# EAGLE design AUDIO_005 (EAGLE 9.6.2)
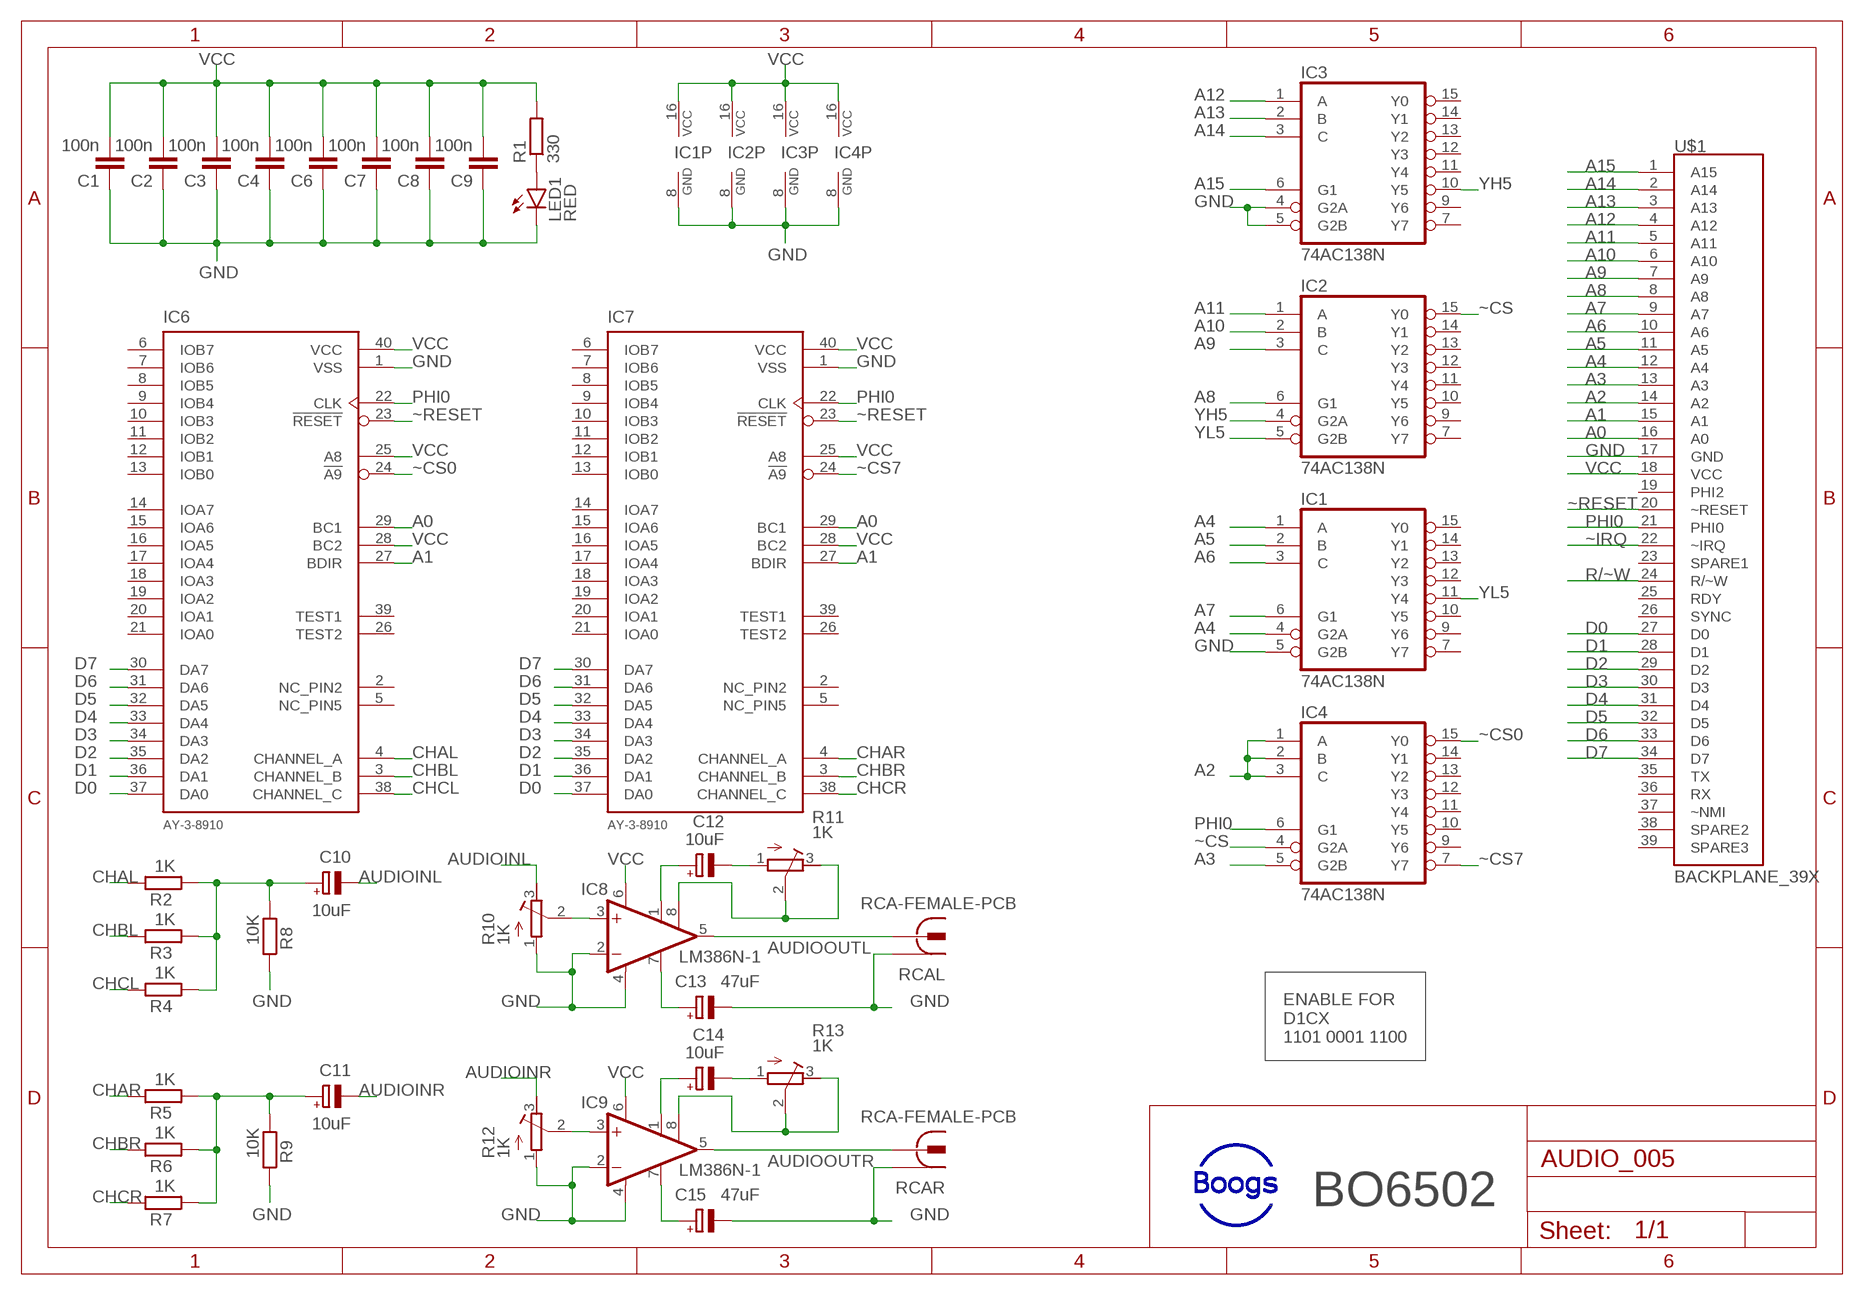
[diagram p0: schematic, sheet 1]

## Parts
C1  100n  C-EU025-025X050  [C025-025X050]
C2  100n  C-EU025-025X050  [C025-025X050]
C3  100n  C-EU025-025X050  [C025-025X050]
C4  100n  C-EU025-025X050  [C025-025X050]
C6  100n  C-EU025-025X050  [C025-025X050]
C7  100n  C-EU025-025X050  [C025-025X050]
C8  100n  C-EU025-025X050  [C025-025X050]
C9  100n  C-EU025-025X050  [C025-025X050]
C10  10uF  CPOL-EUB45181A  [B45181A]
C11  10uF  CPOL-EUB45181A  [B45181A]
C12  10uF  CPOL-EUB45181A  [B45181A]
C13  47uF  CPOL-EUB45181A  [B45181A]
C14  10uF  CPOL-EUB45181A  [B45181A]
C15  47uF  CPOL-EUB45181A  [B45181A]
IC1  74AC138N  [DIL16]
IC2  74AC138N  [DIL16]
IC3  74AC138N  [DIL16]
IC4  74AC138N  [DIL16]
IC6  AY-3-8910  [DIL40]
IC7  AY-3-8910  [DIL40]
IC8  LM386N-1  [DIL08]
IC9  LM386N-1  [DIL08]
LED1  RED  LED5MM  [LED5MM]
R1  330  R-EU_0207/10  [0207/10]
R2  1K  R-EU_0207/10  [0207/10]
R3  1K  R-EU_0207/10  [0207/10]
R4  1K  R-EU_0207/10  [0207/10]
R5  1K  R-EU_0207/10  [0207/10]
R6  1K  R-EU_0207/10  [0207/10]
R7  1K  R-EU_0207/10  [0207/10]
R8  10K  R-EU_0207/10  [0207/10]
R9  10K  R-EU_0207/10  [0207/10]
R10  1K  R-TRIMM3339P  [RTRIM3339P]
R11  1K  R-TRIMM3339P  [RTRIM3339P]
R12  1K  R-TRIMM3339P  [RTRIM3339P]
R13  1K  R-TRIMM3339P  [RTRIM3339P]
RCAL  RCA-FEMALE-PCB  [RCA-FEMALE-PCB]
RCAR  RCA-FEMALE-PCB  [RCA-FEMALE-PCB]
U$1  BACKPLANE_39X  [BP_39X]

## Nets
A0: IC6.29(BC1) IC7.29(BC1) U$1.16(A0)
A1: IC6.27(BDIR) IC7.27(BDIR) U$1.15(A1)
A2: IC4.1(A) IC4.2(B) IC4.3(C) U$1.14(A2)
A3: IC4.5(G2B) U$1.13(A3)
A4: IC1.1(A) IC1.4(G2A) U$1.12(A4)
A5: IC1.2(B) U$1.11(A5)
A6: IC1.3(C) U$1.10(A6)
A7: IC1.6(G1) U$1.9(A7)
A8: IC2.6(G1) U$1.8(A8)
A9: IC2.3(C) U$1.7(A9)
A10: IC2.2(B) U$1.6(A10)
A11: IC2.1(A) U$1.5(A11)
A12: IC3.1(A) U$1.4(A12)
A13: IC3.2(B) U$1.3(A13)
A14: IC3.3(C) U$1.2(A14)
A15: IC3.6(G1) U$1.1(A15)
AUDIOINL: C10.- R10.3(E)
AUDIOINR: C11.- R12.3(E)
AUDIOOUTL: IC8.5(OUT) RCAL.2@1 RCAL.2@2
AUDIOOUTR: IC9.5(OUT) RCAR.2@1 RCAR.2@2
CHAL: IC6.4(CHANNEL_A) R2.1
CHAR: IC7.4(CHANNEL_A) R5.1
CHBL: IC6.3(CHANNEL_B) R3.1
CHBR: IC7.3(CHANNEL_B) R6.1
CHCL: IC6.38(CHANNEL_C) R4.1
CHCR: IC7.38(CHANNEL_C) R7.1
D0: IC6.37(DA0) IC7.37(DA0) U$1.27(D0)
D1: IC6.36(DA1) IC7.36(DA1) U$1.28(D1)
D2: IC6.35(DA2) IC7.35(DA2) U$1.29(D2)
D3: IC6.34(DA3) IC7.34(DA3) U$1.30(D3)
D4: IC6.33(DA4) IC7.33(DA4) U$1.31(D4)
D5: IC6.32(DA5) IC7.32(DA5) U$1.32(D5)
D6: IC6.31(DA6) IC7.31(DA6) U$1.33(D6)
D7: IC6.30(DA7) IC7.30(DA7) U$1.34(D7)
GND: C1.1 C2.1 C3.1 C4.1 C6.1 C7.1 C8.1 C9.1 C13.- C15.- IC1.5(G2B) IC1.8(GND) IC2.8(GND) IC3.4(G2A) IC3.5(G2B) IC3.8(GND) IC4.8(GND) IC6.1(VSS) IC7.1(VSS) IC8.2(-IN) IC8.4(GND) IC9.2(-IN) IC9.4(GND) LED1.K(C) R8.1 R9.1 R10.1(A) R12.1(A) RCAL.1 RCAR.1 U$1.17(GND)
N$1: C10.+ R2.2 R3.2 R4.2 R8.2
N$4: C12.+ IC8.1(GAIN)
N$5: IC8.3(+IN) R10.2(S)
N$6: LED1.A R1.1
N$7: C12.- R11.1(A)
N$8: IC8.8(GAIN) R11.2(S) R11.3(E)
N$9: C13.+ IC8.7(BYPASS)
N$10: IC9.3(+IN) R12.2(S)
N$11: C14.+ IC9.1(GAIN)
N$12: C14.- R13.1(A)
N$13: IC9.8(GAIN) R13.2(S) R13.3(E)
N$14: C15.+ IC9.7(BYPASS)
N$15: C11.+ R5.2 R6.2 R7.2 R9.2
PHI0: IC4.6(G1) IC6.22(CLK) IC7.22(CLK) U$1.21(PHI0)
R/~W: U$1.24(R/~W)
VCC: C1.2 C2.2 C3.2 C4.2 C6.2 C7.2 C8.2 C9.2 IC1.16(VCC) IC2.16(VCC) IC3.16(VCC) IC4.16(VCC) IC6.25(A8) IC6.28(BC2) IC6.40(VCC) IC7.25(A8) IC7.28(BC2) IC7.40(VCC) IC8.6(VS) IC9.6(VS) R1.2 U$1.18(VCC)
YH5: IC2.4(G2A) IC3.10(Y5)
YL5: IC1.11(Y4) IC2.5(G2B)
~CS: IC2.15(Y0) IC4.4(G2A)
~CS0: IC4.15(Y0) IC6.24(!A9)
~CS7: IC4.7(Y7) IC7.24(!A9)
~IRQ: U$1.22(~IRQ)
~RESET: IC6.23(!RESET) IC7.23(!RESET) U$1.20(~RESET)
Unconnected: IC1.7(Y7) IC1.9(Y6) IC1.10(Y5) IC1.12(Y3) IC1.13(Y2) IC1.14(Y1) IC1.15(Y0) IC2.7(Y7) IC2.9(Y6) IC2.10(Y5) IC2.11(Y4) IC2.12(Y3) IC2.13(Y2) IC2.14(Y1) IC3.7(Y7) IC3.9(Y6) IC3.11(Y4) IC3.12(Y3) IC3.13(Y2) IC3.14(Y1) IC3.15(Y0) IC4.9(Y6) IC4.10(Y5) IC4.11(Y4) IC4.12(Y3) IC4.13(Y2) IC4.14(Y1) IC6.2(NC_PIN2) IC6.5(NC_PIN5) IC6.6(IOB7) IC6.7(IOB6) IC6.8(IOB5) IC6.9(IOB4) IC6.10(IOB3) IC6.11(IOB2) IC6.12(IOB1) IC6.13(IOB0) IC6.14(IOA7) IC6.15(IOA6) IC6.16(IOA5) IC6.17(IOA4) IC6.18(IOA3) IC6.19(IOA2) IC6.20(IOA1) IC6.21(IOA0) IC6.26(TEST2) IC6.39(TEST1) IC7.2(NC_PIN2) IC7.5(NC_PIN5) IC7.6(IOB7) IC7.7(IOB6) IC7.8(IOB5) IC7.9(IOB4) IC7.10(IOB3) IC7.11(IOB2) IC7.12(IOB1) IC7.13(IOB0) IC7.14(IOA7) IC7.15(IOA6) IC7.16(IOA5) IC7.17(IOA4) IC7.18(IOA3) IC7.19(IOA2) IC7.20(IOA1) IC7.21(IOA0) IC7.26(TEST2) IC7.39(TEST1) U$1.19(PHI2) U$1.23(SPARE1) U$1.25(RDY) U$1.26(SYNC) U$1.35(TX) U$1.36(RX) U$1.37(~NMI) U$1.38(SPARE2) U$1.39(SPARE3)

## Notes on the sheet
- ENABLE FOR
  D1CX
  1101 0001 1100
- BO6502

## Library data of the parts
C1-C4 C6-C9 = rcl:C-EU: CAPACITOR, European symbol; SPICEPREFIX: C
C10-C15 = rcl:CPOL-EU: POLARIZED CAPACITOR, European symbol; SPICEPREFIX: C
IC1-IC4 = 74xx-eu:74*138: 3-line to 8-line DECODER/DEMULTIPLEXER
IC6 IC7 = AY-3-8910:AY-3-8910: Check availability <https://pricing.snapeda.com/parts/AY-3-8910/General%20Instrument/view-part?ref=eda>; AVAILABILITY: Not in stock; CHECK_PRICES: https://www.snapeda.com/parts/AY-3-8910/General/view-part/?ref=eda; MF: General Instrument; MP: AY-3-8910; PACKAGE: None; PRICE: None; SNAPEDA_LINK: https://www.snapeda.com/parts/AY-3-8910/General/view-part/?ref=snap
IC8 IC9 = linear:LM386?-*: Low Voltage Audio Power Amplifier Source: http://cache.national.com/ds/LM/LM386.pdf
LED1 = led:LED: LED OSRAM: - CHIPLED LG R971, LG N971, LY N971, LG Q971, LY Q971, LO R971, LY R971 LH N974, LH R974 LS Q976, LO Q976, LY Q976 LO Q996 - Hyper CHIPLED LW Q18S LB Q993, LB Q99A, LB R99A - SideLED LS A670, LO A670, LY A670, LG A670, LP A670 LB A673, LV A673, LT A673, LW A673 LH A674 LY A675 LS A676, LA A676, LO A676, LY A676, LW A676 LS A679, LY A679, LG A679 - Hyper Micro SIDELED® LS Y876, LA Y876, LO Y876, LY Y876 LT Y87S - SmartLED LW L88C, LW L88S LB L89C, LB L89S, LG L890 LS L89K, LO L89K, LY L89K LS L896, LA L896, LO L896, LY L896 - TOPLED LS T670, LO T670, LY T670, LG T670, LP T670 LSG T670, LSP T670, LSY T670, LOP T670, LYG T670 LG T671, LOG T671, LSG T671 LB T673, LV T673, LT T673, LW T673 LH T674 LS T676, LA T676, LO T676, LY T676, LB T676, LH T676, LSB T676, LW T676 LB T67C, LV T67C, LT T67C, LS T67K, LO T67K, LY T67K, LW E67C LS E67B, LA E67B, LO E67B, LY E67B, LB E67C, LV E67C, LT E67C LW T67C LS T679, LY T679, LG T679 LS T770, LO T770, LY T770, LG T770, LP T770 LB T773, LV T773, LT T773, LW T773 LH T774 LS E675, LA E675, LY E675, LS T675 LS T776, LA T776, LO T776, LY T776, LB T776 LHGB T686 LT T68C, LB T68C - Hyper Mini TOPLED® LB M676 - Mini TOPLED Santana® LG M470 LS M47K, LO M47K, LY M47K Source: http://www.osram.convergy.de LUXEON: - LUMILED® LXK2-PW12-R00, LXK2-PW12-S00, LXK2-PW14-U00, LXK2-PW14-V00 LXK2-PM12-R00, LXK2-PM12-S00, LXK2-PM14-U00 LXK2-PE12-Q00, LXK2-PE12-R00, LXK2-PE12-S00, LXK2-PE14-T00, LXK2-PE14-U00 LXK2-PB12-K00, LXK2-PB12-L00, LXK2-PB12-M00, LXK2-PB14-N00, LXK2-PB14-P00, LXK2-PB14-Q00 LXK2-PR12-L00, LXK2-PR12-M00, LXK2-PR14-Q00, LXK2-PR14-R00 LXK2-PD12-Q00, LXK2-PD12-R00, LXK2-PD12-S00 LXK2-PH12-R00, LXK2-PH12-S00 LXK2-PL12-P00, LXK2-PL12-Q00, LXK2-PL12-R00 Source: www.luxeon.com KINGBRIGHT: KA-3528ASYC Source: www.kingbright.com
R1-R9 = rcl:R-EU_: RESISTOR, European symbol; SPICEPREFIX: R
R10-R13 = rcl:R-TRIMM: Trimm resistor; SPICEMODEL: X; SPICEPREFIXL: POT
RCAL RCAR = 65xx_family:RCA-FEMALE-PCB
U$1 = 65xx_family:BACKPLANE_39X

## Board
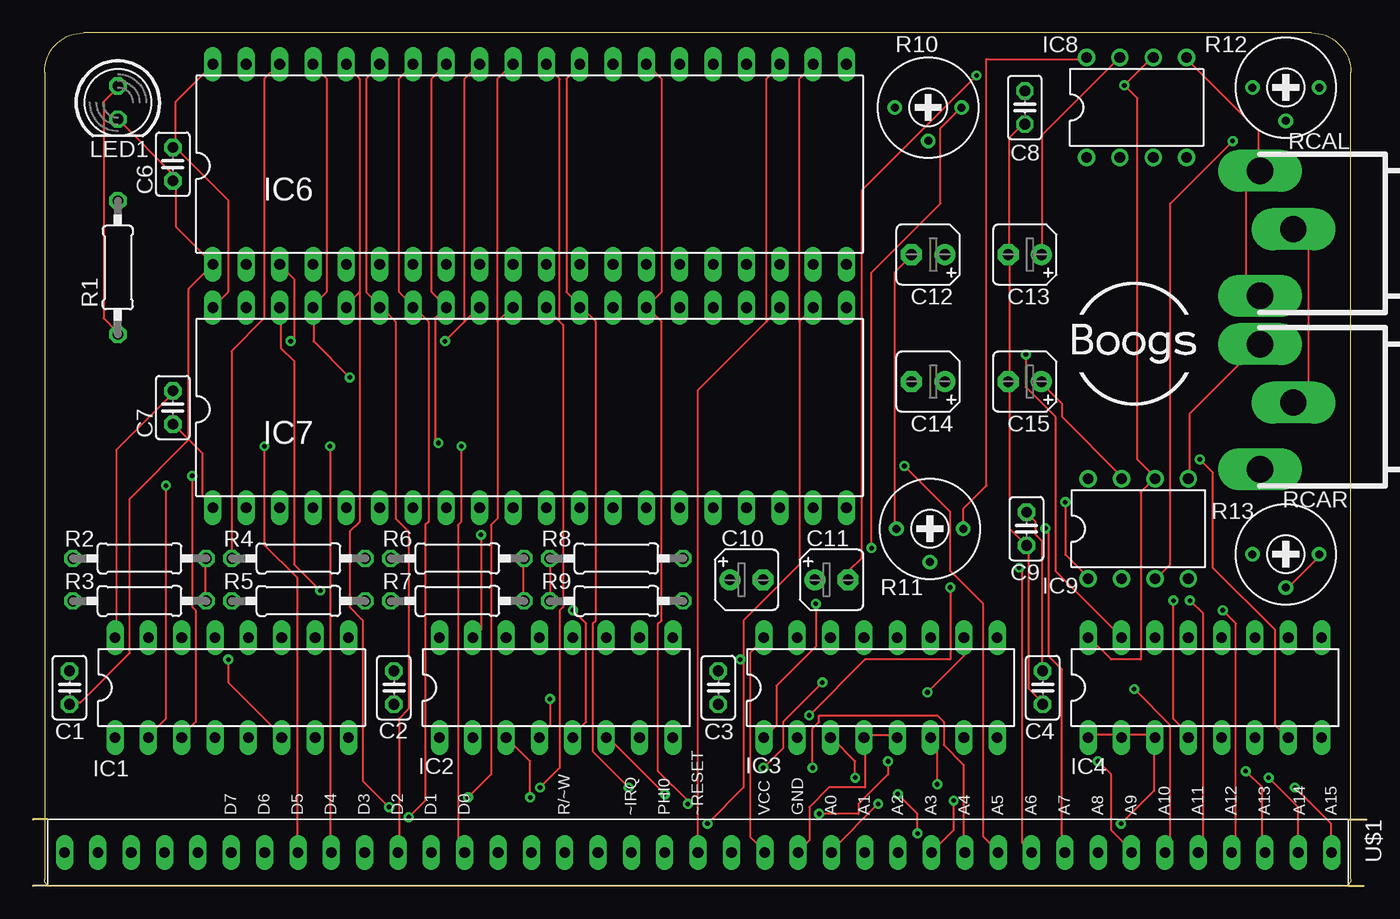
[diagram p1: board, top side]
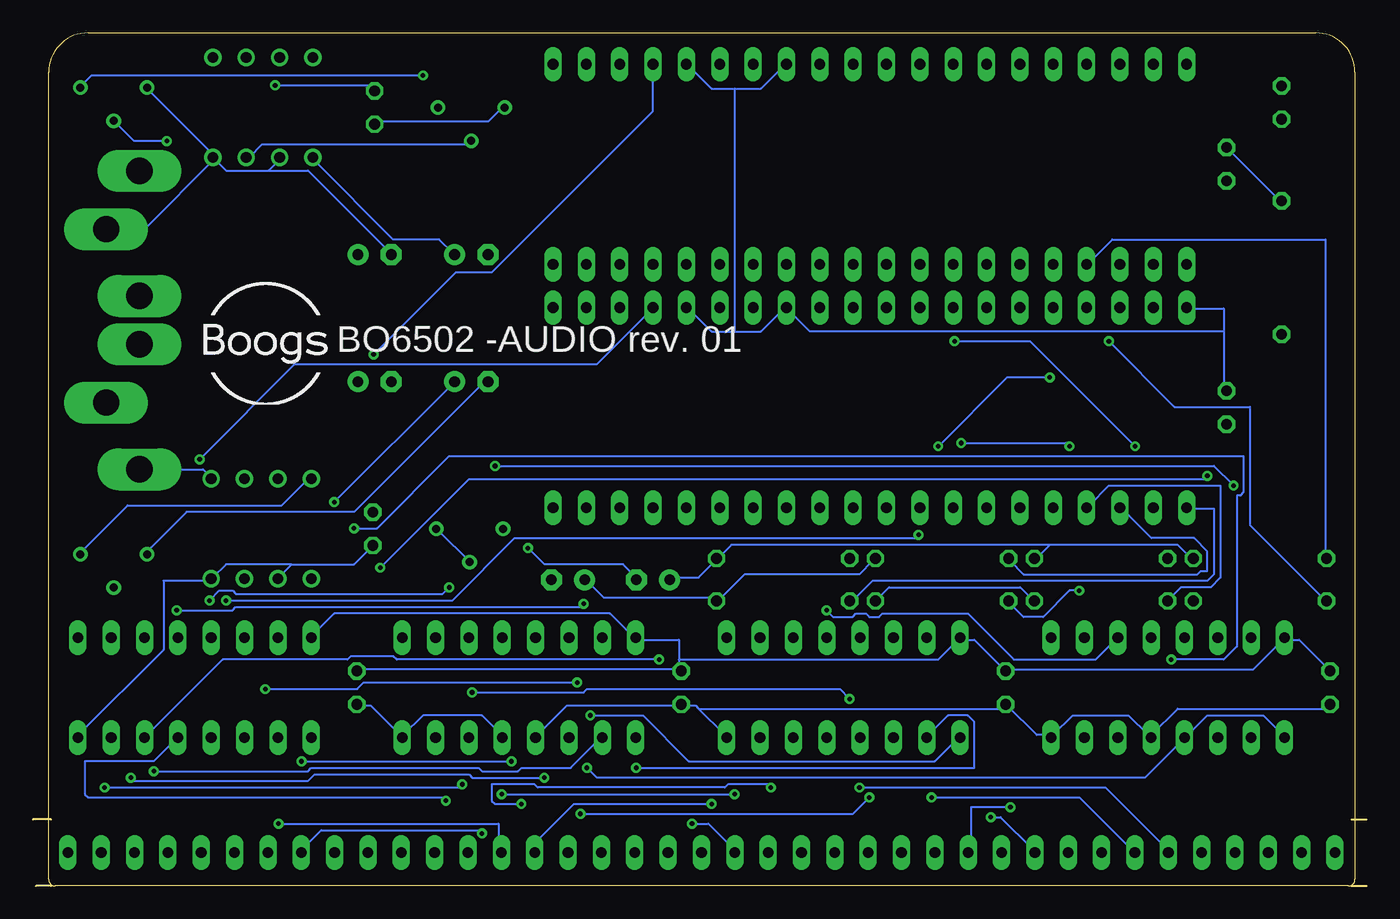
[diagram p2: board, bottom side, seen from below]

Size 101.6 x 65 mm. Coordinates in mm from the lower left corner, seen from the top.
Outline: 1.14,5.08 0,5.08
Outline: 1.14,0 0,0
Outline: 100.2,5.08 101.6,5.08
Outline: 100.2,0 101.35,0
Outline: 1.39,0 99.89,0 arc90 100.39,0.5 100.39,62 arc90 97.39,65 3.89,65 arc90 0.89,62 0.89,0.5 arc90 1.39,0
Copper layers (1*16): Top 0.035mm / dielectric 1.5mm / Bottom 0.035mm
Design rules "default *": minimum track width 6mil, minimum drill 0.35mm, track to track 10mil, track to pad 10mil, pad to pad 10mil, via to via 10mil, smd to smd 6mil, copper to edge 40mil, drill to drill 6mil, minimum pad ring 10mil, minimum via ring 8mil, stop-mask expansion 4mil, vias tented up to drill 15mil, thermal gap 10mil

### Footprints (pad centres in the part's own frame; a part is rotated, then mirrored left to right if it is on the bottom)
C025-025X050 = drill 0.813 octagon: 1 -1.27,0; 2 1.27,0
B45181A = drill 0.813 pad 1.6: + -1.27,0 | drill 0.813 pad 1.6 octagon: - 1.27,0
DIL16 = drill 0.813 long: 1 -8.89,-3.81; 2 -6.35,-3.81; 3 -3.81,-3.81; 4 -1.27,-3.81; 5 1.27,-3.81; 6 3.81,-3.81; 7 6.35,-3.81; 8 8.89,-3.81; 9 8.89,3.81; 10 6.35,3.81; 11 3.81,3.81; 12 1.27,3.81; 13 -1.27,3.81; 14 -3.81,3.81; 15 -6.35,3.81; 16 -8.89,3.81
DIL40 = drill 0.813 long: 1 -24.13,-7.62; 2 -21.59,-7.62; 3 -19.05,-7.62; 4 -16.51,-7.62; 5 -13.97,-7.62; 6 -11.43,-7.62; 7 -8.89,-7.62; 8 -6.35,-7.62; 9 -3.81,-7.62; 10 -1.27,-7.62; 11 1.27,-7.62; 12 3.81,-7.62; 13 6.35,-7.62; 14 8.89,-7.62; 15 11.43,-7.62; 16 13.97,-7.62; 17 16.51,-7.62; 18 19.05,-7.62; 19 21.59,-7.62; 20 24.13,-7.62; 21 24.13,7.62; 22 21.59,7.62; 23 19.05,7.62; 24 16.51,7.62; 25 13.97,7.62; 26 11.43,7.62; 27 8.89,7.62; 28 6.35,7.62; 29 3.81,7.62; 30 1.27,7.62; 31 -1.27,7.62; 32 -3.81,7.62; 33 -6.35,7.62; 34 -8.89,7.62; 35 -11.43,7.62; 36 -13.97,7.62; 37 -16.51,7.62; 38 -19.05,7.62; 39 -21.59,7.62; 40 -24.13,7.62
DIL08 = drill 0.813 pad 1.27: 1 -3.81,-3.81; 2 -1.27,-3.81; 3 1.27,-3.81; 4 3.81,-3.81; 5 3.81,3.81; 6 1.27,3.81; 7 -1.27,3.81; 8 -3.81,3.81
LED5MM = drill 0.813 octagon: A -1.27,0; K 1.27,0
0207/10 = drill 0.813 octagon: 1 -5.08,0; 2 5.08,0
RTRIM3339P = drill 0.61: 1 -2.54,0; 2 0,-2.54; 3 2.54,0
RCA-FEMALE-PCB = drill 2 pad 3.2 long: 1 2.54,0; 2@1 5.08,5.08; 2@2 5.08,-4.445
BP_39X = drill 0.813 long: 1 1.27,59.69; 2 1.27,57.15; 3 1.27,54.61; 4 1.27,52.07; 5 1.27,49.53; 6 1.27,46.99; 7 1.27,44.45; 8 1.27,41.91; 9 1.27,39.37; 10 1.27,36.83; 11 1.27,34.29; 12 1.27,31.75; 13 1.27,29.21; 14 1.27,26.67; 15 1.27,24.13; 16 1.27,21.59; 17 1.27,19.05; 18 1.27,16.51; 19 1.27,13.97; 20 1.27,11.43; 21 1.27,8.89; 22 1.27,6.35; 23 1.27,3.81; 24 1.27,1.27; 25 1.27,-1.27; 26 1.27,-3.81; 27 1.27,-6.35; 28 1.27,-8.89; 29 1.27,-11.43; 30 1.27,-13.97; 31 1.27,-16.51; 32 1.27,-19.05; 33 1.27,-21.59; 34 1.27,-24.13; 35 1.27,-26.67; 36 1.27,-29.21; 37 1.27,-31.75; 38 1.27,-34.29; 39 1.27,-36.83

### Placement (x,y rotation side)
C1  2.79,15.11 90 top
C2  27.5,15.11 90 top
C3  52.22,15.11 90 top
C4  76.93,15.11 90 top
C6  10.67,54.99 90 top
C7  10.67,36.45 90 top
C8  75.56,59.31 90 top
C9  75.69,27.22 90 top
C10  54.36,23.34 0 top
C11  60.83,23.34 0 top
C12  68.2,48.1 180 top
C13  75.56,48.1 180 top
C14  68.2,38.42 180 top
C15  75.56,38.42 180 top
IC1  15.15,15.11 0 top
IC2  39.86,15.11 0 top
IC3  64.57,15.11 0 top
IC4  89.28,15.11 0 top
IC6  37.85,54.99 0 top
IC7  37.85,36.45 0 top
IC8  84.07,59.31 0 top
IC9  84.2,27.22 0 top
LED1  6.48,59.69 270 top
R1  6.48,47.12 90 top
R2  8.13,24.96 0 top
R3  8.13,21.72 0 top
R4  20.24,24.96 0 top
R5  20.24,21.72 0 top
R6  32.34,24.96 0 top
R7  32.34,21.72 0 top
R8  44.45,24.96 0 top
R9  44.45,21.72 0 top
R10  68.2,59.31 0 top
R11  68.33,27.22 0 top
R12  95.44,60.83 0 top
R13  95.44,25.27 0 top
RCAL  98.55,50.04 180 top
RCAR  98.55,36.83 180 top
U$1  39.24,3.81 270 top

### Tracks (layer width: path | path; a pad name or v marks a point on that pad's centre or on a via)
A0  (via drill 0.35)
  Top 0.152: IC6.29 41.64,62.5 40.64,61.5 40.64,45.25 41.64,44.25 IC7.29 41.89,44 42.89,43 42.89,20.25 42.64,20 42.64,10.25 v45.39,7.5 | v64.39,6.25 60.89,2.75 U$1.16
  Bottom 0.152: v64.39,6.25 66.39,6.25 66.64,6.5 66.64,7.75 63.39,7.75 63.14,7.5 48.89,7.5 48.64,7.75 45.64,7.75 v45.39,7.5
A1  (via drill 0.35)
  Top 0.152: IC6.27 46.89,62.5 47.89,61.5 47.89,45.25 46.89,44.25 IC7.27 46.89,44 47.89,43 47.89,20.25 47.64,20 47.64,8.75 49.89,6.5 v49.89,6.25
  Bottom 0.152: U$1.15 63.39,2.75 63.64,3 60.39,6.25 v49.89,6.25
A2  (via drill 0.35)
  Top 0.152: v82.89,4.75 85.39,7.25 85.39,11.25 IC4.3 85.39,11.5 83.14,11.5 IC4.2 82.89,11.5 80.64,11.5 IC4.1
  Bottom 0.152: v82.89,4.75 66.14,4.75 66.14,2.75 U$1.14
A3  (via drill 0.35)
  Top 0.152: v70.14,6.5 70.14,4.25 68.64,2.75 U$1.13
  Bottom 0.152: v70.14,6.5 70.39,6.75 97.39,6.75 97.64,7 97.64,9.5 92.39,9.5 90.64,11.25 IC4.5
A4  (via drill 0.35)
  Top 0.152: v59.39,9 59.39,12 59.89,12.5 59.89,13 68.89,13 69.39,12.5 69.39,10.75 70.89,9.25 70.89,2.75 U$1.12
  Bottom 0.152: IC1.1 6.39,11.5 7.89,13 12.14,13 13.64,11.5 IC1.4 13.89,11.25 16.89,8.25 58.64,8.25 v59.39,9
A5  (via drill 0.35)
  Top 0.152: v10.14,30.5 10.14,12.75 8.89,11.5 IC1.2 | v66.39,32 69.89,28.5 69.89,24 72.39,21.5 72.39,3.75 73.39,2.75 U$1.11
  Bottom 0.152: v10.14,30.5 11.64,32 v66.39,32
A6  (via drill 0.35)
  Top 0.152: v12.14,31.25 12.14,21.25 12.39,21 12.39,12.5 11.39,11.5 IC1.3 | v75.14,24.25 75.39,24 75.39,3.25 75.89,2.75 U$1.10
  Bottom 0.152: v12.14,31.25 12.39,31 68.39,31 v75.14,24.25
A7  (via drill 0.35)
  Top 0.152: v14.89,17.25 14.89,15.5 18.89,11.5 IC1.6 | v77.14,27.25 77.39,27 77.39,17.5 78.39,16.5 78.39,2.75 U$1.9
  Bottom 0.152: v14.89,17.25 10.89,17.25 9.89,18.25 9.89,29.75 9.64,29.75 9.39,30 9.39,32.75 69.89,32.75 75.39,27.25 v77.14,27.25
A8  (via drill 0.35)
  Top 0.152: v48.14,7 43.89,11.25 IC2.6 | v65.89,7 67.39,5.5 v67.39,4
  Bottom 0.152: v65.89,7 v48.14,7 | v67.39,4 67.64,4.25 79.64,4.25 81.14,2.75 U$1.8
A9  (via drill 0.35)
  Top 0.152: v37.89,6.75 37.89,9.5 36.14,11.25 IC2.3 | v59.89,5.5 62.89,5.5 62.89,6.25 65.14,8.5 v65.14,9.5 | v81.14,9.5 82.14,8.5 82.14,4.25 83.64,2.75 U$1.7
  Bottom 0.152: v37.89,6.75 39.14,5.5 v59.89,5.5 | v81.14,9.5 v65.14,9.5
A10  (via drill 0.35)
  Top 0.152: v55.64,9 57.14,10.5 57.14,12.5 v60.14,15.5 | v83.89,15 86.64,12.25 86.64,3 86.39,2.75 U$1.6
  Bottom 0.152: v55.64,9 29.89,9 29.89,12.5 30.39,13 31.89,13 33.39,11.5 IC2.2 | v60.14,15.5 76.39,15.5 76.89,15 v83.89,15
A11  (via drill 0.35)
  Top 0.152: v59.14,13 63.39,17.25 69.89,17.25 v69.89,22.75 | v88.14,21.75 89.14,20.75 89.14,3 88.89,2.75 U$1.5
  Bottom 0.152: v59.14,13 55.14,13 51.64,9.5 32.89,9.5 31.14,11.25 IC2.1 | v69.89,22.75 70.39,22.25 86.14,22.25 86.39,22.5 87.39,22.5 v88.14,21.75
A12  (via drill 0.35)
  Top 0.152: v59.64,21.5 59.64,18.25 56.64,15.25 56.64,12.25 55.89,11.5 IC3.1 | v90.64,21 91.64,20 91.64,3 91.39,2.75 U$1.4
  Bottom 0.152: v59.64,21.5 59.89,21.25 86.14,21.25 86.39,21 v90.64,21
A13  (via drill 0.35)
  Top 0.152: v92.39,8.75 93.64,7.5 93.64,2.75 U$1.3
  Bottom 0.152: v92.39,8.75 80.64,8.75 80.39,9 67.64,9 67.39,8.75 64.64,8.75 64.39,9 60.64,9 58.39,11.25 IC3.2
A14  (via drill 0.35)
  Top 0.152: v62.64,8.25 62.64,9.5 60.89,11.25 IC3.3 | v94.14,8.25 96.39,6 96.39,2.75 U$1.2
  Bottom 0.152: v62.64,8.25 68.14,8.25 68.39,8.5 80.14,8.5 80.64,8 93.89,8 v94.14,8.25
A15  (via drill 0.35)
  Top 0.152: v68.89,7.75 68.89,10.75 68.39,11.25 IC3.6 | v96.14,7.5 98.89,4.75 98.89,2.75 U$1.1
  Bottom 0.152: v68.89,7.75 69.14,7.5 v96.14,7.5
AUDIOINL  (via drill 0.35)
  Top 0.152: v63.89,25.75 63.89,46.75 69.14,52 69.14,57.75 70.64,59.25 R10.3
  Bottom 0.152: v63.89,25.75 62.64,24.5 56.64,24.5 55.64,23.5 C10.-
AUDIOINR  (via drill 0.35)
  Top 0.152: v71.89,61.75 63.14,53 63.14,25 62.14,24 62.14,23.5 C11.-
  Bottom 0.152: v71.89,61.75 97.14,61.75 97.89,61 R12.3
AUDIOOUTL
  Top 0.152: IC8.5 87.89,63 93.39,57.5 93.39,54.5 RCAL.2@2 93.39,54.25 92.39,53.25 92.39,46 93.39,45 RCAL.2@1
AUDIOOUTR
  Top 0.152: RCAR.2@2 93.39,41.25 88.14,36 88.14,31.25 IC9.5
  Bottom 0.152: RCAR.2@1 88.64,31.75 88.14,31.25 IC9.5
CHAL
  Bottom 0.152: R2.1 3.14,25 3.14,49.25 19.39,49.25 21.14,47.5 IC6.4
CHAR
  Bottom 0.152: R5.1 15.14,21.75 14.14,22.75 11.89,22.75 11.14,23.5 11.14,30.5 19.64,30.5 21.14,29 IC7.4
CHBL  (via drill 0.35)
  Top 0.152: v19.64,41.5 19.89,41.75 19.89,46.25 18.89,47.25 IC6.3
  Bottom 0.152: v19.64,41.5 14.64,36.5 8.89,36.5 8.89,27.5 3.14,21.75 R3.1
CHBR
  Bottom 0.152: IC7.3 18.64,28.75 16.39,26.5 13.14,26.5 12.14,25.5 12.14,24 12.64,24 12.89,23.75 26.14,23.75 27.14,24.75 R6.1
CHCL
  Top 0.152: R4.1 15.14,25 15.14,40.75 17.64,43.25 17.64,61.5 18.64,62.5 IC6.38
CHCR  (via drill 0.35)
  Top 0.152: v21.89,22.5 19.89,24.5 19.89,40 18.89,41 18.89,44 IC7.38
  Bottom 0.152: v21.89,22.5 22.64,22.5 24.64,20.5 26.14,20.5 27.14,21.5 R7.1
D0  (via drill 0.35)
  Top 0.152: IC6.37 21.39,62.5 22.39,61.5 22.39,45.25 21.39,44.25 IC7.37 21.39,44 21.39,41.5 v24.14,38.75 | v32.64,33.5 32.64,27.75 32.39,27.5 32.39,3.25 32.89,2.75 U$1.27
  Bottom 0.152: v32.64,33.5 27.39,38.75 v24.14,38.75
D1  (via drill 0.35)
  Top 0.152: 24.89,45.25 23.89,44.25 IC7.36 | 24.89,45.25 24.89,61.5 23.89,62.5 IC6.36 | v27.14,6 25.14,8 25.14,20.25 24.14,21.25 24.14,27 24.89,27.75 24.89,45.25
  Bottom 0.152: v27.14,6 30.14,6 30.14,2.75 U$1.28
D2
  Top 0.152: IC6.35 26.39,62.5 25.39,61.5 25.39,45.25 26.39,44.25 IC7.35 26.64,44 27.64,43 27.64,28 28.64,27 28.64,13.5 27.89,12.75 27.89,2.75 U$1.29
D3  (via drill 0.35)
  Top 0.152: v28.64,5.25 29.89,6.5 29.89,27.5 30.14,27.75 30.14,43 29.14,44 IC7.34 28.89,44.25 27.89,45.25 27.89,61.5 28.89,62.5 IC6.34
  Bottom 0.152: v28.64,5.25 27.89,5.25 25.39,2.75 U$1.30
D4  (via drill 0.35)
  Top 0.152: v22.64,33.5 22.64,2.75 U$1.31 | v30.89,33.75 30.64,34 30.64,43.25 31.39,44 IC7.33 31.39,44.25 30.39,45.25 30.39,61.5 31.39,62.5 IC6.33
  Bottom 0.152: v22.64,33.5 22.89,33.75 v30.89,33.75
D5  (via drill 0.35)
  Top 0.152: v17.64,33.5 17.64,26 20.14,23.5 20.14,2.75 U$1.32 | 32.89,43 33.89,44 IC7.32 | 32.89,43 v31.39,41.5 | 32.89,43 32.89,61.5 33.89,62.5 IC6.32
  Bottom 0.152: v17.64,33.5 25.64,41.5 v31.39,41.5
D6  (via drill 0.35)
  Top 0.152: v33.14,6.75 34.89,8.5 34.89,27.5 35.39,28 35.39,43 | 35.39,43 36.39,44 IC7.31 | 35.39,43 35.39,61.5 36.39,62.5 IC6.31
  Bottom 0.152: v33.14,6.75 21.89,6.75 17.89,2.75 U$1.33
D7  (via drill 0.35)
  Top 0.152: v38.64,7.5 40.14,9 40.14,21 40.39,21.25 40.39,42.75 40.14,43 | 40.14,43 39.14,44 IC7.30 | 40.14,43 40.14,61.5 39.14,62.5 IC6.30
  Bottom 0.152: v38.64,7.5 19.89,7.5 15.14,2.75 U$1.34
GND
  Top 0.152: C8.1 75.39,58 74.39,57 74.39,48.25 C13.- 74.39,48 74.39,38.5 C15.- 74.39,38.25 74.39,27.25 75.64,26 C9.1 75.89,25.75 75.89,15 76.89,14 C4.1 | RCAR.1 96.14,37 97.14,38 97.14,49 96.14,50 RCAL.1 | LED1.K 6.64,58.25 10.64,54.25 10.64,53.75 C6.1 10.89,53.5 10.89,50.25 13.64,47.5 IC6.1 13.64,47.25 11.89,45.5 11.89,34 | R9.1 39.39,21.75 39.39,24.75 R8.1 | 11.89,34 10.89,35 C7.1 | 11.89,34 12.89,33 12.89,29.75 13.64,29 IC7.1 | U$1.17 58.39,2.75 59.14,3.5 59.14,6 60.64,7.5 63.39,7.5 63.39,11.25 IC3.4 63.39,11.5 65.64,11.5 IC3.5 | 11.89,34 7.39,29.5 7.39,17.75 3.64,14 2.89,14 C1.1
  Bottom 0.152: 81.89,24.5 77.14,24.5 75.89,25.75 C9.1 | 81.89,24.5 82.89,23.5 IC9.2 | 81.89,24.5 86.89,24.5 87.89,23.5 IC9.4 88.14,23.25 91.64,23.25 91.64,18 98.14,11.5 IC4.8 | R10.1 65.89,59.25 66.89,58.25 75.39,58.25 C8.1 | R12.1 92.89,60.75 87.64,55.5 IC8.4 | 83.64,54.5 82.89,55.25 IC8.2 | 83.64,54.5 86.89,54.5 87.64,55.25 IC8.4 | IC8.4 87.89,55.25 92.89,50.25 95.89,50.25 RCAL.1 | 83.64,54.5 80.64,54.5 74.39,48.25 C13.- | R9.1 39.14,21.75 37.64,23.25 12.14,23.25 11.64,23.75 11.64,28.75 13.64,28.75 IC7.1 | C1.1 2.89,13.75 3.14,13.5 14.39,13.5 16.39,11.5 IC1.5 16.64,11.5 18.14,13 22.39,13 23.89,11.5 IC1.8 24.14,11.5 25.14,11.5 27.39,13.75 C2.1 27.64,13.75 27.89,13.5 50.89,13.5 | C4.1 76.89,13.75 75.89,13.75 73.64,11.5 IC3.8 73.39,11.5 71.89,13 67.39,13 65.89,11.5 IC3.5 | 50.89,13.5 51.14,13.75 52.14,13.75 C3.1 52.39,13.75 60.89,13.75 63.14,11.5 IC3.4 | 50.89,13.5 48.89,11.5 IC2.8
N$1
  Top 0.152: R3.2 13.14,21.75 13.14,24.75 R2.2
  Bottom 0.152: C10.+ 52.89,23.5 50.89,23.5 49.64,24.75 R8.2 49.39,25 48.39,26 24.14,26 | 24.14,26 25.14,25 R4.2 | 24.14,26 14.39,26 13.39,25 R2.2
N$4
  Bottom 0.152: IC8.1 80.14,55.25 74.14,49.25 70.64,49.25 69.64,48.25 C12.+
N$5
  Bottom 0.152: R10.2 68.39,56.75 68.64,56.5 84.14,56.5 85.14,55.5 IC8.3
N$6
  Top 0.152: R1.1 6.39,42.25 5.39,43.25 5.39,59.75 6.39,60.75 LED1.A
N$7
  Top 0.152: R11.1 65.64,27.25 65.64,46.75 66.89,48 C12.-
N$8
  Top 0.152: IC8.8 80.14,63 72.64,63 72.64,30.5 70.89,28.75 70.89,27.25 R11.3
  Bottom 0.152: R11.2 68.39,24.75 70.64,27 R11.3
N$9
  Top 0.152: IC8.7 82.64,63 76.89,57.25 76.89,48.25 C13.+
N$10  (via drill 0.35)
  Top 0.152: v91.39,56.75 86.64,52 86.64,24.5 85.64,23.5 IC9.3
  Bottom 0.152: v91.39,56.75 93.89,56.75 95.39,58.25 R12.2
N$11  (via drill 0.35)
  Top 0.152: v78.64,29.25 78.64,25.25 80.39,23.5 IC9.1
  Bottom 0.152: v78.64,29.25 69.64,38.25 C14.+
N$12
  Bottom 0.152: R13.1 92.89,25.5 89.89,28.5 77.14,28.5 67.39,38.25 67.14,38.25 C14.-
N$13
  Top 0.152: R13.2 95.64,22.75 97.89,25 97.89,25.25 R13.3
  Bottom 0.152: IC9.8 80.64,31 82.64,29 94.39,29 97.89,25.5 R13.3
N$14
  Top 0.152: IC9.7 82.89,31.25 78.39,35.75 78.39,36.75 76.89,38.25 C15.+
N$15
  Top 0.152: R6.2 37.39,24.75 37.39,21.75 R7.2
  Bottom 0.152: C11.+ 59.39,23.25 58.14,22 49.89,22 49.64,21.75 R9.2 49.39,21.75 47.39,23.75 38.64,23.75 37.64,24.75 R6.2 | R5.2 25.39,21.75 26.39,22.75 36.39,22.75 37.39,21.75 R7.2
PHI0  (via drill 0.35)
  Top 0.152: v51.39,4.75 54.14,7.5 54.14,17.25 | 54.14,17.25 54.14,20.25 58.39,24.5 58.39,43 | 58.39,43 59.39,44 IC7.22 | 58.39,43 58.39,61.5 59.39,62.5 IC6.22 | 54.14,17.25 v53.89,17.25
  Bottom 0.152: v51.39,4.75 50.14,4.75 48.14,2.75 U$1.21 | v53.89,17.25 73.89,17.25 74.14,17.5 77.39,17.5 77.64,17.25 87.14,17.25 92.89,11.5 IC4.6
VCC  (via drill 0.35)
  Top 0.152: IC6.40 13.64,62.5 10.89,59.75 10.89,56.5 C6.2 10.89,56.25 14.89,52.25 14.89,45.25 13.89,44.25 IC7.40 | IC8.6 85.14,63 v83.14,61 84.14,60 84.14,32.5 85.39,31.25 IC9.6 85.39,31 84.39,30 84.39,17.25 82.14,17.25 80.64,18.75 IC4.16 | C9.2 75.89,28.25 76.39,27.75 76.39,26.75 76.89,26.25 76.89,16.5 C4.2 | U$1.18 55.64,2.75 54.64,3.75 54.64,17.75 55.64,18.75 IC3.16 | C7.2 10.64,37.5 6.39,33.25 6.39,19 IC1.16
  Bottom 0.152: 48.14,42.25 49.89,42.25 51.64,44 IC7.25 | 48.14,42.25 46.14,42.25 44.39,44 IC7.28 44.14,44 42.39,42.25 10.89,42.25 | 48.14,60.75 49.89,60.75 51.64,62.5 IC6.25 | 48.14,60.75 46.14,60.75 44.39,62.5 IC6.28 | 48.14,60.75 48.14,42.25 | 10.89,42.25 10.89,44 13.64,44 IC7.40 | 10.89,42.25 10.89,37.75 C7.2 | R1.2 6.64,52.25 10.64,56.25 C6.2 | v83.14,61 75.89,61 75.64,60.75 C8.2 | C1.2 2.89,16.5 5.14,18.75 6.14,18.75 IC1.16 6.39,18.75 8.64,16.5 27.39,16.5 C2.2 27.64,16.5 29.89,18.75 30.89,18.75 IC2.16 31.14,18.75 32.64,17.25 52.39,17.25 | 52.39,17.25 52.39,18.75 55.64,18.75 IC3.16 55.89,19 57.64,20.75 78.64,20.75 80.39,19 IC4.16 | 52.39,17.25 52.39,16.5 | 52.39,16.5 76.89,16.5 C4.2 | 52.39,16.5 C3.2
YH5  (via drill 0.35)
  Top 0.152: v39.39,14.25 39.39,12.25 38.64,11.5 IC2.4 | v68.14,14.75 70.89,17.5 70.89,18.75 IC3.10
  Bottom 0.152: v39.39,14.25 40.14,15 59.39,15 59.64,14.75 v68.14,14.75
YL5  (via drill 0.35)
  Top 0.152: v41.14,21 42.14,20 42.14,12.5 41.14,11.5 IC2.5
  Bottom 0.152: v41.14,21 40.64,20.5 39.14,20.5 38.89,20.75 38.14,20.75 37.89,20.5 37.14,20.5 36.89,20.75 30.39,20.75 26.89,17.25 20.64,17.25 19.14,18.75 IC1.11
~CS  (via drill 0.35)
  Top 0.152: v34.14,26.75 34.14,19.5 33.64,19 IC2.15 | v86.89,21.75 86.89,12.75 87.89,11.75 87.89,11.5 IC4.4
  Bottom 0.152: v34.14,26.75 34.39,26.5 64.89,26.5 69.64,21.75 v86.89,21.75
~CS0  (via drill 0.35)
  Top 0.152: v75.64,40.5 75.64,38 77.89,35.75 77.89,24 82.89,19 IC4.15
  Bottom 0.152: v75.64,40.5 69.39,46.75 66.64,46.75 54.39,59 54.39,62.5 IC6.24
~CS7  (via drill 0.35)
  Top 0.152: v88.89,32.5 89.89,31.5 89.89,24.25 94.64,19.5 94.64,12.25 95.39,11.5 IC4.7
  Bottom 0.152: v88.89,32.5 81.64,39.75 58.64,39.75 54.39,44 IC7.24
~RESET
  Top 0.152: 55.89,43 56.89,44 IC7.23 | 55.89,43 50.64,37.75 50.64,2.75 U$1.20 | 55.89,43 55.89,61.5 56.89,62.5 IC6.23

### Text on the board
tNames: BO6502 - SDCARD rev. 01 | D7 | D6 | D5 | D4 | D3 | D2 | D1 | D0 | R/~W | ~IRQ | PHI0 | ~RESET | VCC | GND | A0 | A1 | A2 | A3 | A4 | A5 | A6 | A7 | A8 | A9 | A10 | A11 | A12 | A13 | A14 | A15
bNames: BO6502 -AUDIO rev. 01